# EAGLE design Cleaning_Robot (EAGLE 9.6.2)
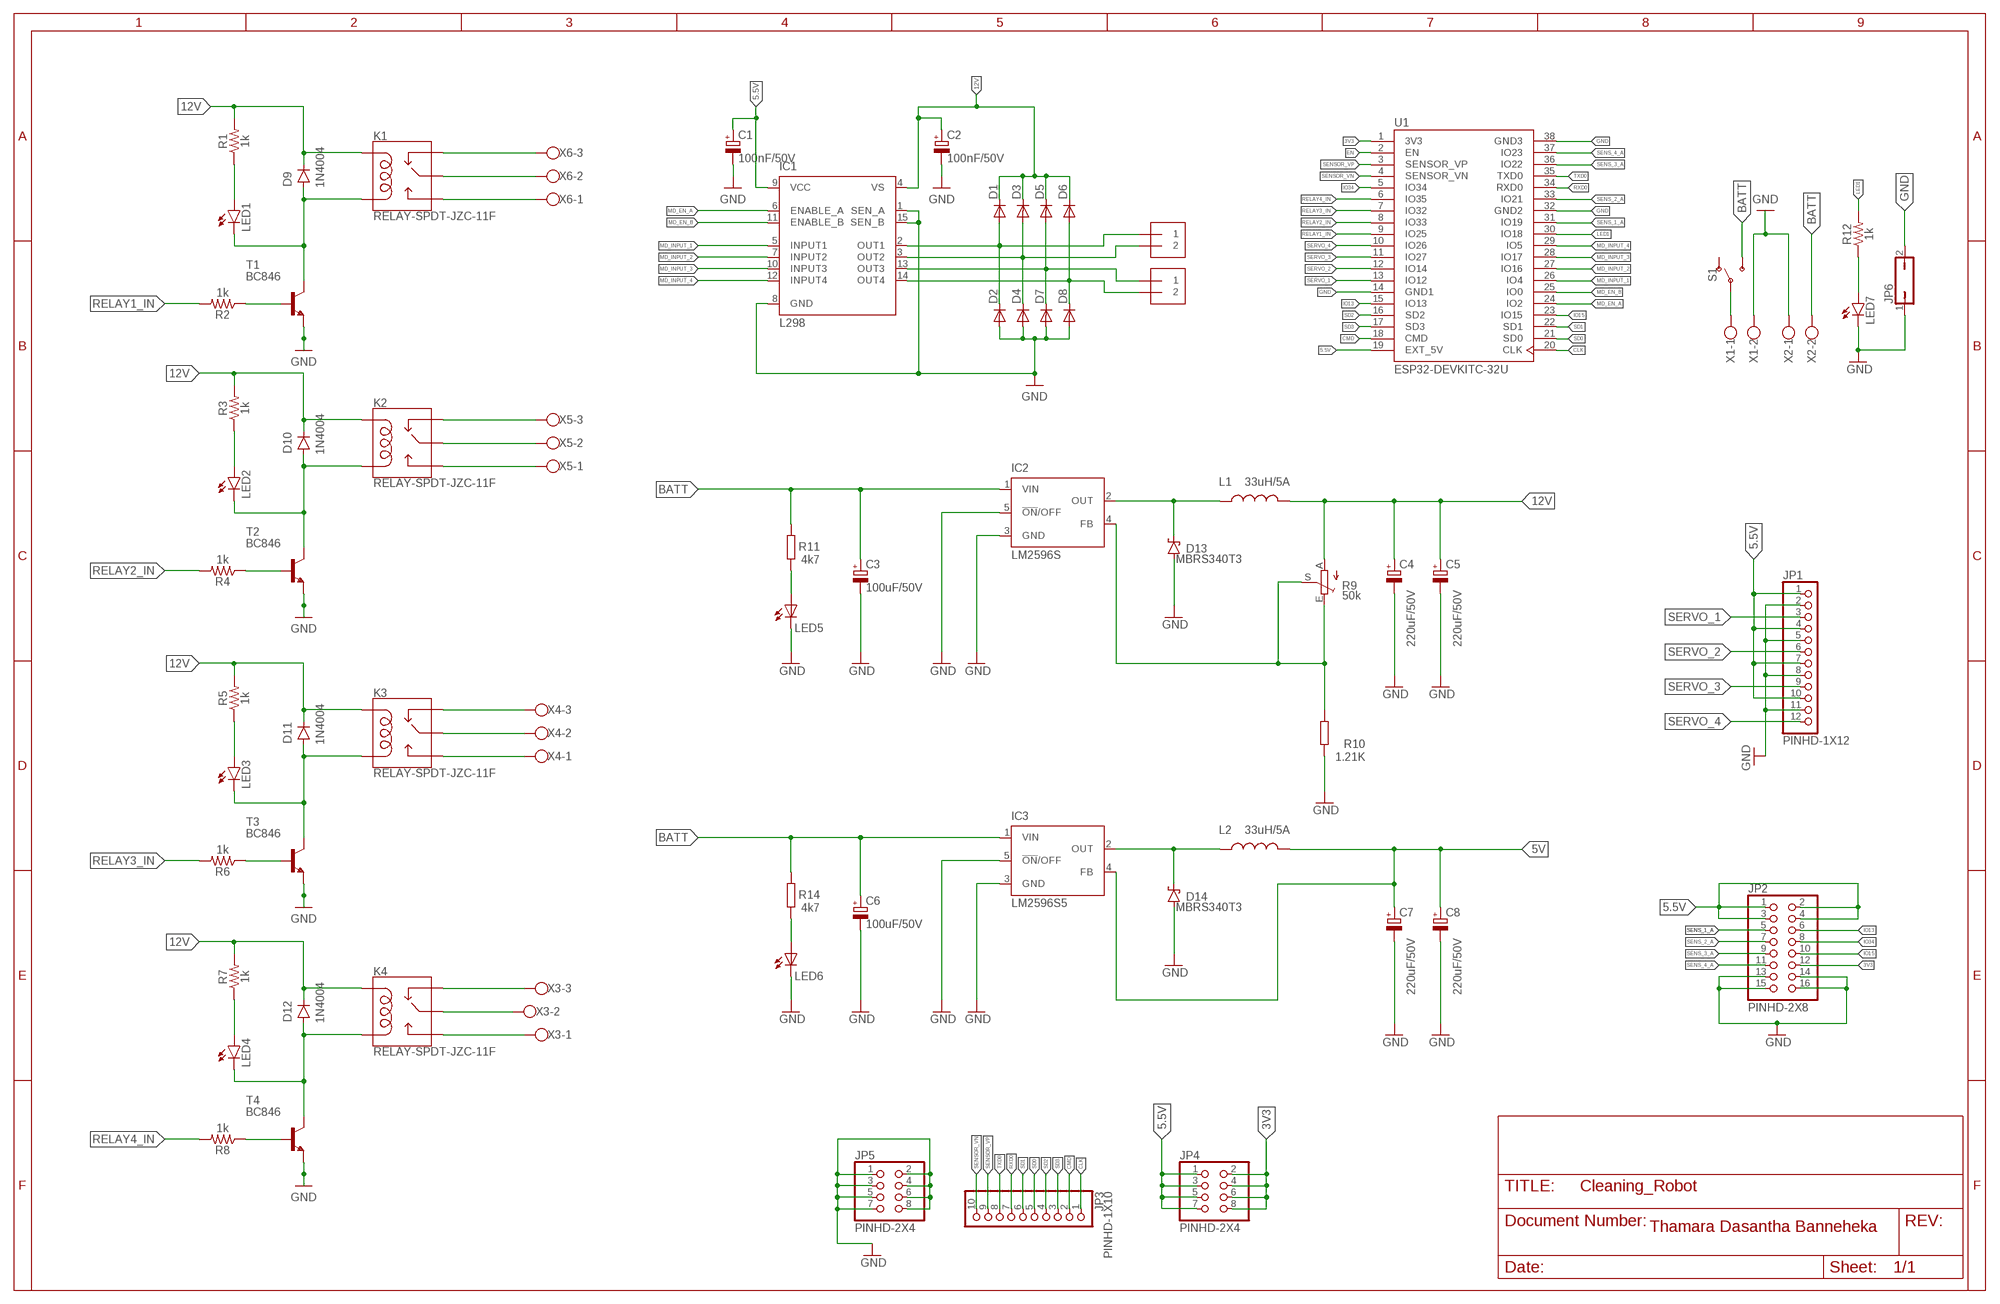
[diagram p0: schematic, sheet 1]

## Parts
C1  100nF/50V  CPOL-EU153CLV-0405  [153CLV-0405]
C2  100nF/50V  CPOL-EU153CLV-0405  [153CLV-0405]
C3  100uF/50V  CPOL-EU153CLV-0810  [153CLV-0810]
C4  220uF/50V  CPOL-EU140CLH-1010  [140CLH-1010]
C5  220uF/50V  CPOL-EU140CLH-1010  [140CLH-1010]
C6  100uF/50V  CPOL-EU153CLV-0810  [153CLV-0810]
C7  220uF/50V  CPOL-EU153CLV-1010  [153CLV-1010]
C8  220uF/50V  CPOL-EU153CLV-1010  [153CLV-1010]
D1  DIODE-SOD123  [SOD123]
D2  DIODE-SOD123  [SOD123]
D3  DIODE-SOD123  [SOD123]
D4  DIODE-SOD123  [SOD123]
D5  DIODE-SOD123  [SOD123]
D6  DIODE-SOD123  [SOD123]
D7  DIODE-SOD123  [SOD123]
D8  DIODE-SOD123  [SOD123]
D9  1N4004  [DO-41]
D10  1N4004  [DO-41]
D11  1N4004  [DO-41]
D12  1N4004  [DO-41]
D13  MBRS340T3  [SMC]
D14  MBRS340T3  [SMC]
IC1  L298  [MULTIWATT-15]
IC2  LM2596S  [TO263-5]
IC3  LM2596S5  LM2596S  [TO263-5]
J2  1X2-3.5MM  [1X2-3.5MM]
J3  1X2-3.5MM  [1X2-3.5MM]
JP1  PINHD-1X12  [1X12]
JP2  PINHD-2X8  [2X08]
JP3  PINHD-1X10  [1X10]
JP4  PINHD-2X4  [2X04]
JP5  PINHD-2X4  [2X04]
JP6  JP1Q  [JP1]
K1  RELAY-SPDT-JZC-11F  [RELAY-JZC]
K2  RELAY-SPDT-JZC-11F  [RELAY-JZC]
K3  RELAY-SPDT-JZC-11F  [RELAY-JZC]
K4  RELAY-SPDT-JZC-11F  [RELAY-JZC]
L1  33uH/5A  INDUCTORPWR  [CDRH125]
L2  33uH/5A  INDUCTORPWR  [CDRH125]
LED1  LEDCHIP-LED0805  [CHIP-LED0805]
LED2  LEDCHIP-LED0805  [CHIP-LED0805]
LED3  LEDCHIP-LED0805  [CHIP-LED0805]
LED4  LEDCHIP-LED0805  [CHIP-LED0805]
LED5  LEDCHIPLED_0805  [CHIPLED_0805]
LED6  LEDCHIPLED_0805  [CHIPLED_0805]
LED7  LEDCHIP-LED0805  [CHIP-LED0805]
R1  1k  RESISTOR0805  [0805]
R2  1k  RESISTOR0805  [0805]
R3  1k  RESISTOR0805  [0805]
R4  1k  RESISTOR0805  [0805]
R5  1k  RESISTOR0805  [0805]
R6  1k  RESISTOR0805  [0805]
R7  1k  RESISTOR0805  [0805]
R8  1k  RESISTOR0805  [0805]
R9  50k  TRIM_EU-S64W  [S64W]
R10  1.21K  R-EU_R0805  [R0805]
R11  4k7  R-EU_R0805  [R0805]
R12  1k  RESISTOR0805  [0805]
R14  4k7  R-EU_R0805  [R0805]
S1  SWITCH-SPDT-PTH-11.6X4.0MM-KIT  [SWITCH_SPDT_PTH_11.6X4.0MM_KIT]
T1  BC846  [SOT23]
T2  BC846  [SOT23]
T3  BC846  [SOT23]
T4  BC846  [SOT23]
U1  ESP32-DEVKITC-32U  [MODULE_ESP32-DEVKITC-32U]
X1  W237-102  [W237-102]
X2  W237-102  [W237-102]
X3  W237-103  [W237-103]
X4  W237-103  [W237-103]
X5  W237-103  [W237-103]
X6  W237-103  [W237-103]

## Nets
3V3: JP2.12 JP4.2 JP4.4 JP4.6 JP4.8 U1.1(3V3)
5.5V: C1.+ IC1.9(VCC) JP1.1 JP1.4 JP1.7 JP1.10 JP2.1 JP2.2 JP2.3 JP2.4 JP4.1 JP4.3 JP4.5 JP4.7 U1.19(EXT_5V)
5V: C7.+ C8.+ IC3.4(FB) L2.2
12V: C2.+ C4.+ C5.+ D1.C D3.C D5.C D6.C D9.C D10.C D11.C D12.C IC1.4(VS) K1.5(COIL1) K2.5(COIL1) K3.5(COIL1) K4.5(COIL1) L1.2 R1.2 R3.2 R5.2 R7.2 R9.A
BATT: C3.+ C6.+ IC2.1(VIN) IC3.1(VIN) R11.2 R14.2 S1.3(S) X2.2
CLK: JP3.1 U1.20(CLK)
CMD: JP3.2 U1.18(CMD)
COM: K1.4(MAIN) K2.4(MAIN) K3.4(MAIN) X4.2 X5.2 X6.2
EN: U1.2(EN)
GND: C1.- C2.- C3.- C4.- C5.- C6.- C7.- C8.- D2.A D4.A D7.A D8.A D13.A D14.A IC1.1(SEN_A) IC1.8(GND) IC1.15(SEN_B) IC2.3(GND) IC2.5(!ON!/OFF) IC3.3(GND) IC3.5(!ON!/OFF) JP1.2 JP1.5 JP1.8 JP1.11 JP2.13 JP2.14 JP2.15 JP2.16 JP5.1 JP5.2 JP5.3 JP5.4 JP5.5 JP5.6 JP5.7 JP5.8 JP6.1 JP6.2 LED5.C LED6.C LED7.C R10.1 T1.2(E) T2.2(E) T3.2(E) T4.2(E) U1.14(GND1) U1.32(GND2) U1.38(GND3) X1.2 X2.1
IO13: JP2.6 U1.15(IO13)
IO15: JP2.10 U1.23(IO15)
IO34: JP2.8 U1.5(IO34)
LED1: R12.2 U1.30(IO18)
MD_EN_A: IC1.6(ENABLE_A) U1.24(IO2)
MD_EN_B: IC1.11(ENABLE_B) U1.25(IO0)
MD_INPUT_1: IC1.5(INPUT1) U1.26(IO4)
MD_INPUT_2: IC1.7(INPUT2) U1.27(IO16)
MD_INPUT_3: IC1.10(INPUT3) U1.28(IO17)
MD_INPUT_4: IC1.12(INPUT4) U1.29(IO5)
N$1: D1.A D2.C IC1.2(OUT1) J2.1
N$2: D3.A D4.C IC1.3(OUT2) J2.2
N$3: D6.A D8.C IC1.14(OUT4) J3.2
N$4: D5.A D7.C IC1.13(OUT3) J3.1
N$5: D10.A K2.1(COIL2) LED2.C T2.3(C)
N$6: LED2.A R3.1
N$7: R4.1 T2.1(B)
N$8: D9.A K1.1(COIL2) LED1.C T1.3(C)
N$9: D11.A K3.1(COIL2) LED3.C T3.3(C)
N$10: LED1.A R1.1
N$11: LED3.A R5.1
N$12: R2.1 T1.1(B)
N$13: R6.1 T3.1(B)
N$14: D12.A K4.1(COIL2) LED4.C T4.3(C)
N$15: LED4.A R7.1
N$16: R8.1 T4.1(B)
N$17: K4.2(NC) X3.3
N$18: D13.C IC2.2(OUT) L1.1
N$19: K4.4(MAIN) X3.2
N$20: IC2.4(FB) R9.E R9.S R10.2
N$21: LED5.A R11.1
N$22: K4.3(NO) X3.1
N$23: D14.C IC3.2(OUT) L2.1
N$26: LED6.A R14.1
N$37: S1.2(P) X1.1
N$44: LED7.A R12.1
NC: K1.2(NC) K2.2(NC) K3.2(NC) X4.3 X5.3 X6.3
NO: K1.3(NO) K2.3(NO) K3.3(NO) X4.1 X5.1 X6.1
RELAY1_IN: R2.2 U1.9(IO25)
RELAY2_IN: R4.2 U1.8(IO33)
RELAY3_IN: R6.2 U1.7(IO32)
RELAY4_IN: R8.2 U1.6(IO35)
RXD0: JP3.7 U1.34(RXD0)
SD0: JP3.5 U1.21(SD0)
SD1: JP3.6 U1.22(SD1)
SD2: JP3.4 U1.16(SD2)
SD3: JP3.3 U1.17(SD3)
SENS_1_A: JP2.5 U1.31(IO19)
SENS_2_A: JP2.7 U1.33(IO21)
SENS_3_A: JP2.9 U1.36(IO22)
SENS_4_A: JP2.11 U1.37(IO23)
SENSOR_VN: JP3.10 U1.4(SENSOR_VN)
SENSOR_VP: JP3.9 U1.3(SENSOR_VP)
SERVO_1: JP1.3 U1.13(IO12)
SERVO_2: JP1.6 U1.12(IO14)
SERVO_3: JP1.9 U1.11(IO27)
SERVO_4: JP1.12 U1.10(IO26)
TXD0: JP3.8 U1.35(TXD0)
Unconnected: S1.1(O)

## Notes on the sheet
- Thamara Dasantha Banneheka

## Library data of the parts
C1-C8 = rcl:CPOL-EU: POLARIZED CAPACITOR, European symbol; SPICEPREFIX: C
D1-D8 = diode:DIODE-: DIODE
D9-D12 = Diodes:1N4004: DIODE GEN PURP 400V 1A DO41 Manufacturer's datasheet <https://www.mccsemi.com/pdf/Products/1N4001-1N4007(DO-41).pdf>; CREATED_BY: PCBLayout.com; DIGIKEY_PART_NUMBER: 1N4004MSCT-ND; MANUFACTURER: Micro Commercial Co; MPN: 1N4004; PACKAGE: DO-41
D13 D14 = diode:MBRS3*0T3: SCHOTTKY BARRIER RECTIFIER 3.0 AMPERES 20, 30, 40 VOLT Source: MBRS340T3-D.pdf
IC1 = st-microelectronics:L298: DUAL FULL-BRIDGE DRIVER; MPN: L298N; OC_FARNELL: 1589425; OC_NEWARK: 32M1527
IC2 IC3 = national-semiconductor:LM2596: SIMPLE SWITCHER® Power Converter 150 kHz 3A Step-Down Voltage Regulator Source: http://www.national.com/ds/LM/LM2596.pdf; MF: NATIONAL SEMICONDUCTOR; MPN: LM2596S-ADJ/NOPB; OC_FARNELL: 9494367; OC_NEWARK: 41K3842
J2 J3 = adafruit:1X2: 3.5mm Terminal block http://www.ladyada.net/library/pcb/eaglelibrary.html
JP1 = Connector:PINHD-1X12: PIN HEADER; CATEGORY: CONNECTOR; SUB-CATEGORY: PIN-HEADER
JP2 = Connector:PINHD-2X8: PIN HEADER; CATEGORY: CONNECTOR; SUB-CATEGORY: PIN-HEADER
JP3 = Connector:PINHD-1X10: PIN HEADER; CATEGORY: Headers; DESCRIPTION: Header, Straight, 10 Position; MANUFACTURER: Generic; MPN: Generic; OPERATING_TEMPERATURE: Generic; PART_STATUS: Active; PITCH: 0.100" (2.54mm); ROHS_COMPLIANCE: Generic; SERIES: Generic; SUB-CATEGORY: Headers, Male Pins; TYPE: Board to Board or Cable, Unshrouded, Through Hole, Straight
JP4 JP5 = Connector:PINHD-2X4: PIN HEADER; CATEGORY: Headers; DESCRIPTION: Header, Straight, 2x4 Position; MANUFACTURER: Generic; MPN: Generic; OPERATING_TEMPERATURE: Generic; PART_STATUS: Active; PITCH: 0.100" (2.54mm); ROHS_COMPLIANCE: Generic; SERIES: Generic; SUB-CATEGORY: Headers, Male Pins; TYPE: Board to Board or Cable, Unshrouded, Through Hole, Straight
JP6 = jumper:JP1Q: JUMPER
K1-K4 = SparkFun-Electromechanical:RELAY-SPDT: SPDT Electromechanical Relay Single-pole, double-throw sealed relays. When current is applied to the coil, it throws a simple changeover switch, terminating the connection from the NC contact to ground and closing the NO contact. Use them to switch high voltage/high current devices. SparkFun Products JQX-15F: Relay SPDT Sealed - 20A <https://www.sparkfun.com/products/10924> (COM-10924) JZC-11F: Relay SPDT Sealed <https://www.sparkfun.com/products/100> (COM-00100); PROD_ID: COMP-09533; SF_SKU: COM-00100
L1 L2 = SparkFun-Passives:INDUCTOR: Inductors Basic Inductor/Choke - 0603 and 1206. Footprints are not proven and vary greatly between part numbers.
LED1-LED4 LED7 = led:LED: LED
LED5 LED6 = adafruit:LED: LED
R1-R8 R12 = SparkFun-Resistors:RESISTOR: Generic Resistor Package
R9 = pot:TRIM_EU-: POTENTIOMETER
R10 R11 R14 = rcl:R-EU_: RESISTOR, European symbol; SPICEPREFIX: R
S1 = SparkFun-Switches:SWITCH-SPDT: Single Pole, Double Throw (SPDT) Switch Single-pole, double-throw (SPDT) switch. Variant Overview SMD-AYZ0202 Surface Mount DPDT Switch <https://www.sparkfun.com/products/597> (COM-00597) Used on e.g. LilyPad Arduino USB - ATmega32U4 Board <https://www.sparkfun.com/products/12049> PTH-11.6X4.0MM SPDT Mini Power Switch <https://www.sparkfun.com/products/102> (COM-00102) Used on e.g. SparkFun Simon Says - Through-Hole Soldering Kit <https://www.sparkfun.com/products/10547> (KIT-10547) PTH-11.6X4.0MM-KIT KIT version of SPDT Mini Power Switch - Simplifies soldering by removing tStop of switch pins - only one side can be soldered. PTH-11.6X4.0MM-LOCK LOCK version of SPDT Mini Power Switch - Offset pins hold switch in place for easier soldering. SMD-RIGHT-ANGLE Surface Mount Right Angle Switch <https://www.sparkfun.com/products/10860> (COM-10860) Used on e.g. SparkFun ESP8266 Thing <https://www.sparkfun.com/products/13231>; PROD_ID: SWCH-08261; SF_SKU: COM-00102
T1-T4 = transistor:BC846: NPN TRANSISTOR
U1 = ESP32-DEVKITC-32U:ESP32-DEVKITC-32U: ESP32-DEVKITC Check availability <https://pricing.snapeda.com/parts/ESP32-DEVKITC-32U/Espressif%20Systems/view-part?ref=eda>; AVAILABILITY: In Stock; DESCRIPTION: ESP32-WROOM-32UE series Transceiver; 802.11 b/g/n (Wi-Fi, WiFi, WLAN), Bluetooth® Smart Ready 4.x Dual Mode Evaluation Board; MF: Espressif Systems; MP: ESP32-DEVKITC-32U; PACKAGE: CUSTOM-38 ESPRESSIF; PRICE: None; PURCHASE-URL: https://pricing.snapeda.com/search?q=ESP32-DEVKITC-32U&ref=eda
X1 X2 = con-wago-500:W237-102: WAGO SCREW CLAMP; MPN: 237-102; OC_FARNELL: unknown; OC_NEWARK: 70K9898
X3-X6 = con-wago-500:W237-103: WAGO SCREW CLAMP; MPN: 237-103; OC_FARNELL: unknown; OC_NEWARK: 18M7116

## Board
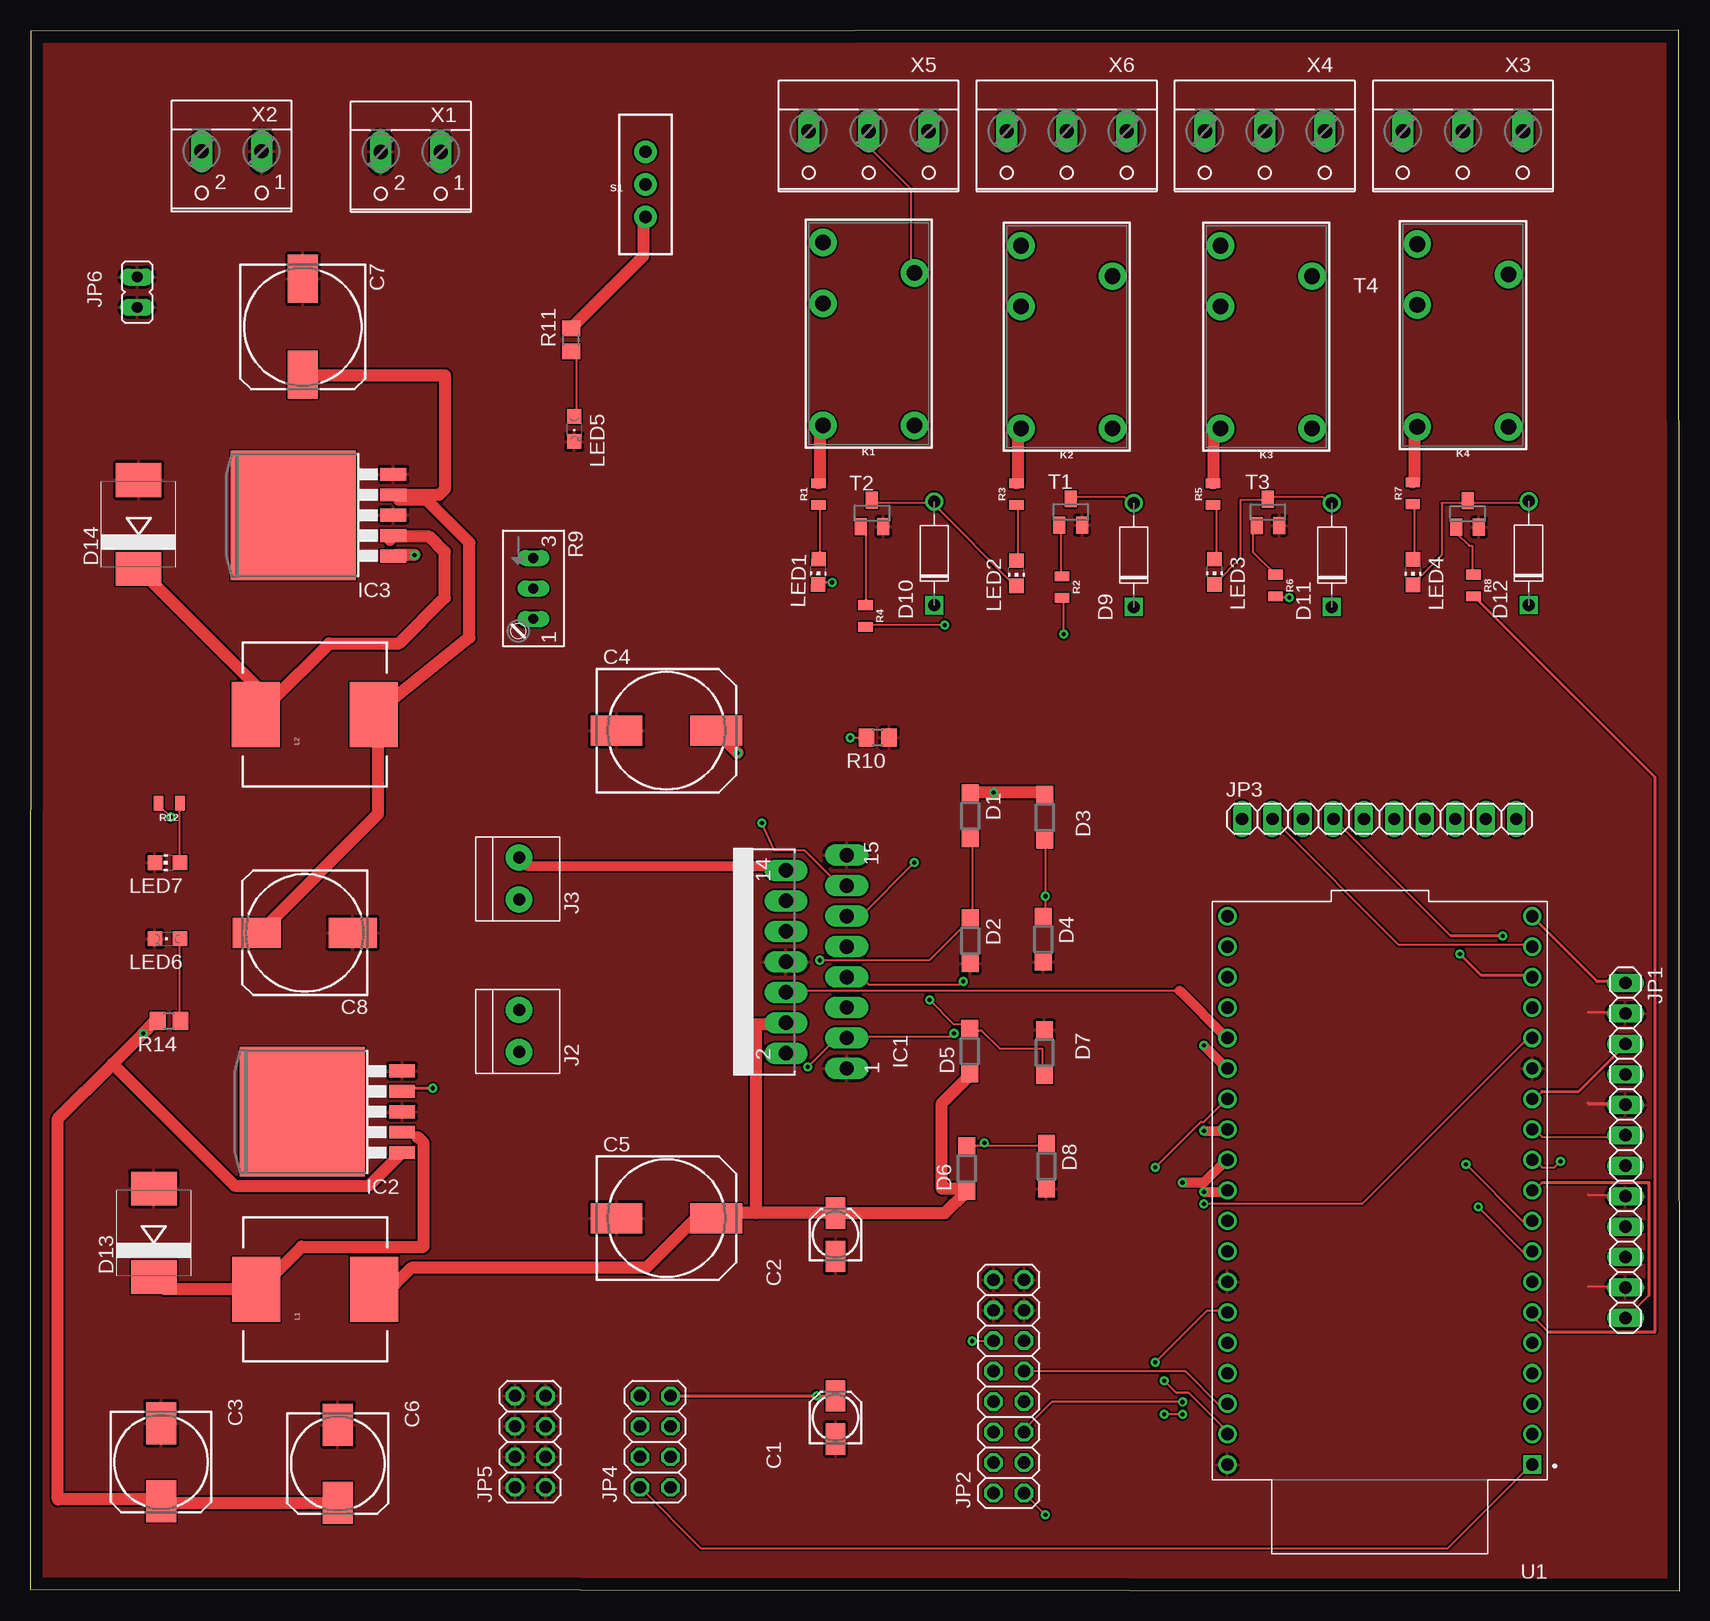
[diagram p1: board, top side]
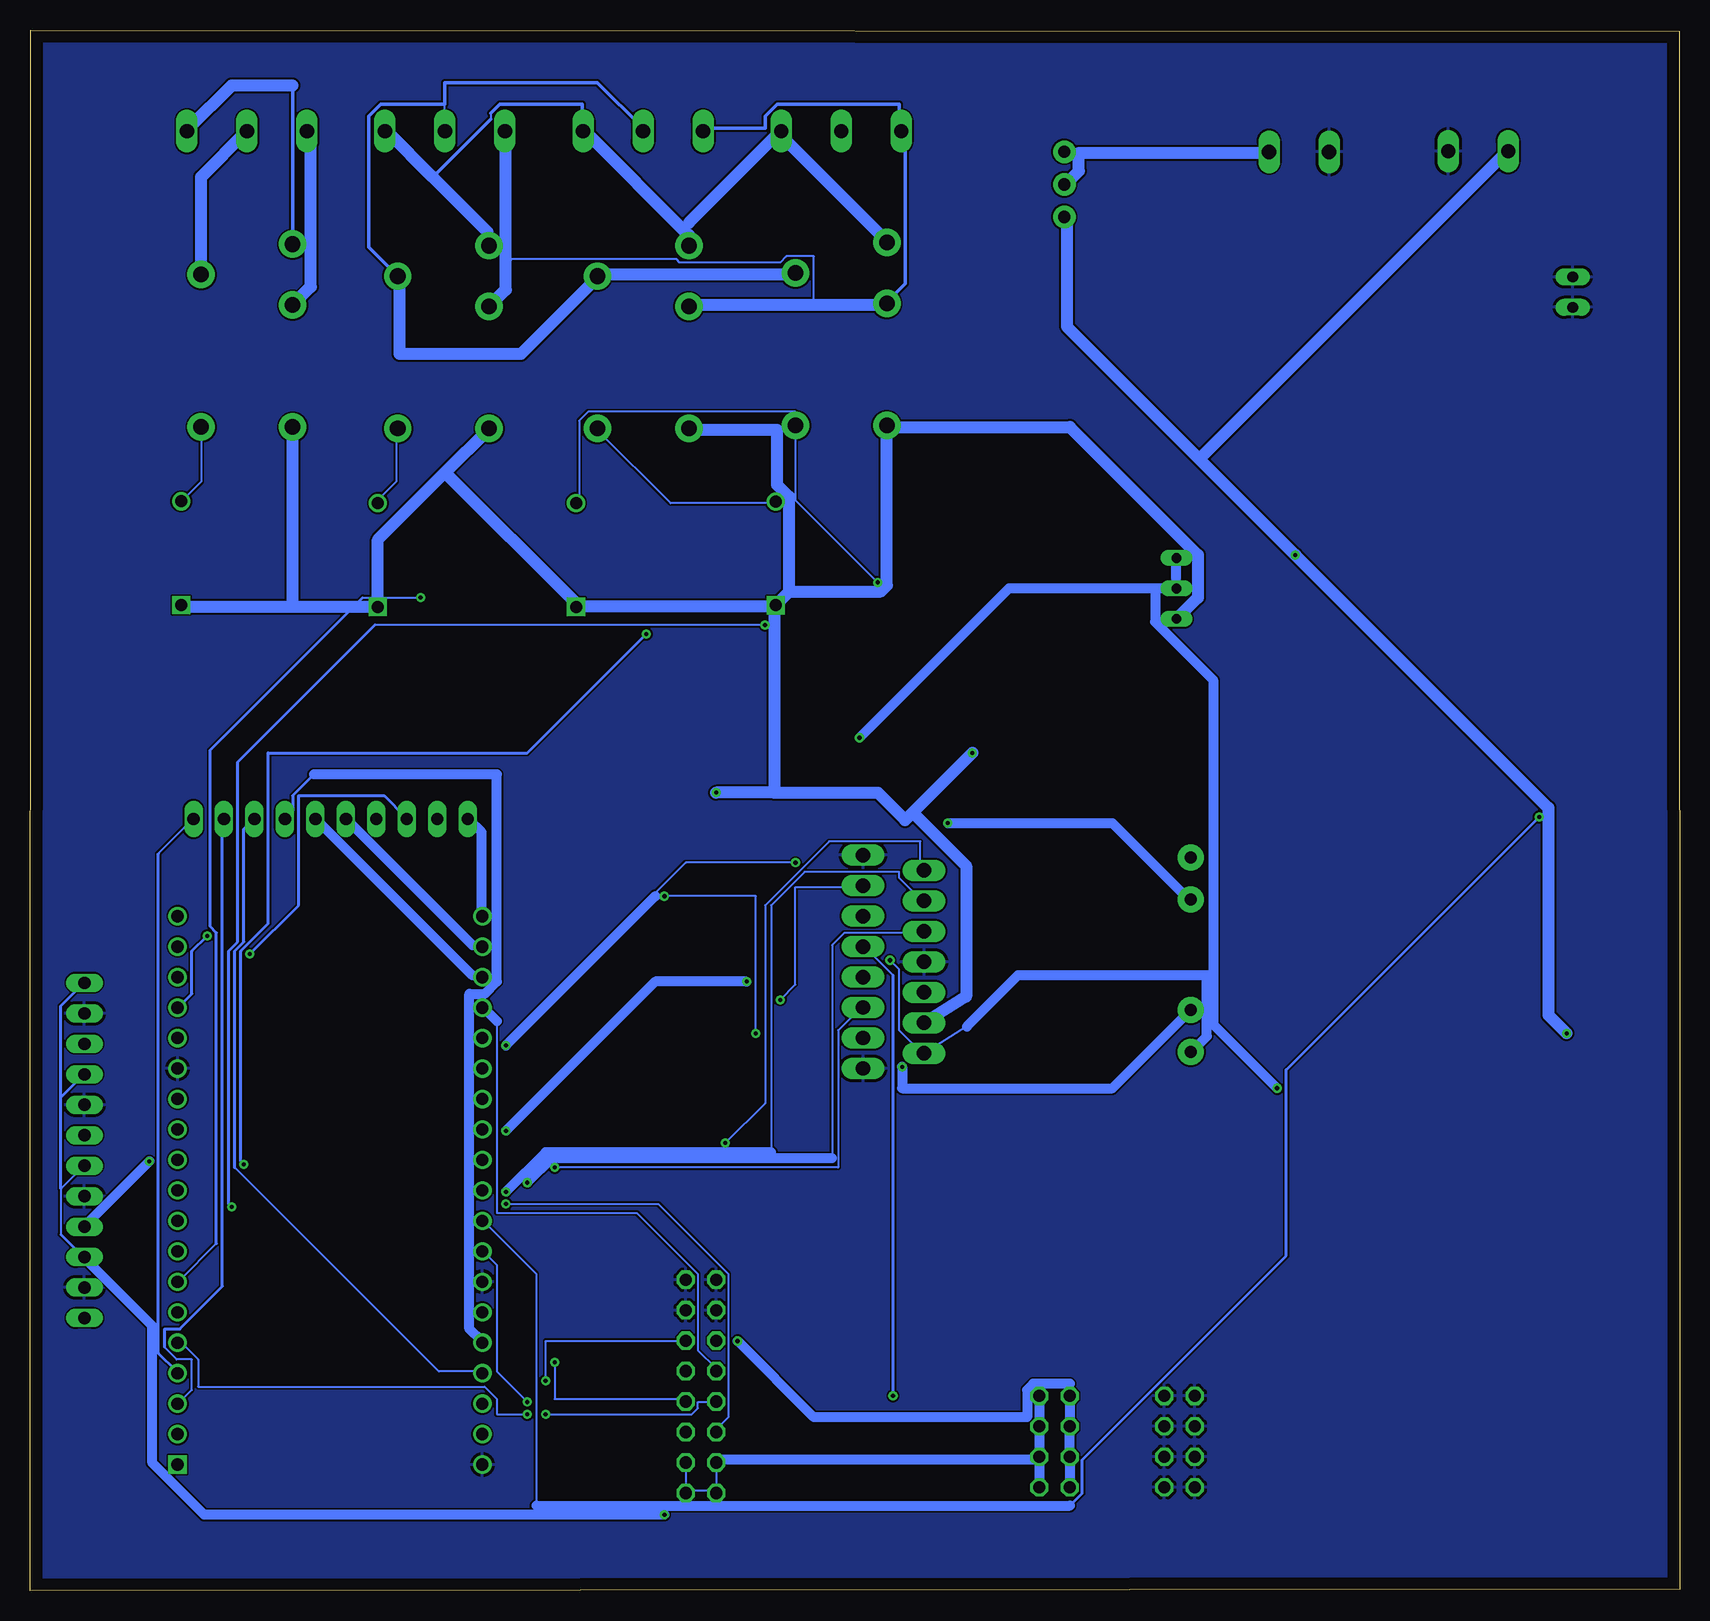
[diagram p2: board, bottom side, seen from below]

Size 137.49 x 130.12 mm. Coordinates in mm from the lower left corner, seen from the top.
Outline: 0,0.14 137.49,0 137.41,130.12 0.05,130.01 0,0.14
Copper layers (1*16): Top 0.035mm / dielectric 1.5mm / Bottom 0.035mm
Design rules "default": minimum track width 6mil, minimum drill 0.35mm, track to track 6mil, track to pad 6mil, pad to pad 6mil, via to via 6mil, smd to smd 6mil, copper to edge 40mil, drill to drill 6mil, minimum pad ring 10mil, minimum via ring 8mil, stop-mask expansion 4mil, vias tented up to drill 0mil, thermal gap 10mil

### Footprints (pad centres in the part's own frame; a part is rotated, then mirrored left to right if it is on the bottom)
153CLV-0405 = smd 2.6 x 1.6: + 1.8,0; - -1.8,0
153CLV-0810 = smd 3.5 x 2.5: + 3.25,0; - -3.25,0
140CLH-1010 = smd 4.3 x 2.5: + 4.15,0; - -4.15,0
153CLV-1010 = smd 4 x 2.5: + 4,0; - -4,0
SOD123 = smd 1.4 x 1.4: A 1.9,0; C -1.9,0
DO-41 = drill 1: A 4.325,0 | drill 1 square: C -4.325,0
SMC = smd 2.8 x 3.8: A 3.7,0; C -3.7,0
MULTIWATT-15 = drill 1.2 long: 1 -8.89,-7.62; 2 -7.62,-2.54; 3 -6.35,-7.62; 4 -5.08,-2.54; 5 -3.81,-7.62; 6 -2.54,-2.54; 7 -1.27,-7.62; 8 0,-2.54; 9 1.27,-7.62; 10 2.54,-2.54; 11 3.81,-7.62; 12 5.08,-2.54; 13 6.35,-7.62; 14 7.62,-2.54; 15 8.89,-7.62
TO263-5 = smd 1.067 x 2.159: 1 -3.404,-5.791; 2 -1.702,-5.791; 3 0,-5.791; 4 1.702,-5.791; 5 3.404,-5.791 | smd 10.8 x 10.41: 6 0,2.54
1X2-3.5MM = drill 1 pad 2.184: 1 1.8,0; 2 -1.7,0
1X12 = drill 1.016 long: 1 -13.97,0; 2 -11.43,0; 3 -8.89,0; 4 -6.35,0; 5 -3.81,0; 6 -1.27,0; 7 1.27,0; 8 3.81,0; 9 6.35,0; 10 8.89,0; 11 11.43,0; 12 13.97,0
2X08 = drill 1.016 octagon: 1 -8.89,-1.27; 2 -8.89,1.27; 3 -6.35,-1.27; 4 -6.35,1.27; 5 -3.81,-1.27; 6 -3.81,1.27; 7 -1.27,-1.27; 8 -1.27,1.27; 9 1.27,-1.27; 10 1.27,1.27; 11 3.81,-1.27; 12 3.81,1.27; 13 6.35,-1.27; 14 6.35,1.27; 15 8.89,-1.27; 16 8.89,1.27
1X10 = drill 1.016 long: 1 -11.43,0; 2 -8.89,0; 3 -6.35,0; 4 -3.81,0; 5 -1.27,0; 6 1.27,0; 7 3.81,0; 8 6.35,0; 9 8.89,0; 10 11.43,0
2X04 = drill 1.016 octagon: 1 -3.81,-1.27; 2 -3.81,1.27; 3 -1.27,-1.27; 4 -1.27,1.27; 5 1.27,-1.27; 6 1.27,1.27; 7 3.81,-1.27; 8 3.81,1.27
JP1 = drill 0.914 long: 1 0,-1.27; 2 0,1.27
RELAY-JZC = drill 1.3 pad 2.286: 1 3.81,-8.89; 2 -3.81,1.27; 3 -3.81,6.35; 4 3.81,3.81; 5 -3.81,-8.89
CDRH125 = smd 5.4 x 4: 1 0,4.9; 2 0,-4.9
CHIP-LED0805 = smd 1.2 x 1.2: A 0,-1.05; C 0,1.05
CHIPLED_0805 = smd 1.2 x 1.2: A 0,-1.05; C 0,1.05
0805 = smd 0.8 x 1.2: 1 -0.9,0; 2 0.9,0
S64W = drill 0.813 long: A 2.54,1.27; E -2.54,1.27; S 0,1.27
R0805 = smd 1.3 x 1.5: 1 -0.95,0; 2 0.95,0
SWITCH_SPDT_PTH_11.6X4.0MM_KIT = drill 1.016 pad 1.88: 1 0,2.718; 2 0,0; 3 0,-2.718
SOT23 = smd 1 x 1.4: 1 -0.95,-1.1; 2 0.95,-1.1; 3 0,1.1
MODULE_ESP32-DEVKITC-32U = drill 1.02 square: 1 -12.7,22.85 | drill 1.02: 2 -12.7,20.31; 3 -12.7,17.77; 4 -12.7,15.23; 5 -12.7,12.69; 6 -12.7,10.15; 7 -12.7,7.61; 8 -12.7,5.07; 9 -12.7,2.53; 10 -12.7,-0.01; 11 -12.7,-2.55; 12 -12.7,-5.09; 13 -12.7,-7.63; 14 -12.7,-10.17; 15 -12.7,-12.71; 16 -12.7,-15.25; 17 -12.7,-17.79; 18 -12.7,-20.33; 19 -12.7,-22.87; 20 12.7,-22.87; 21 12.7,-20.33; 22 12.7,-17.79; 23 12.7,-15.25; 24 12.7,-12.71; 25 12.7,-10.17; 26 12.7,-7.63; 27 12.7,-5.09; 28 12.7,-2.55; 29 12.7,-0.01; 30 12.7,2.53; 31 12.7,5.07; 32 12.7,7.61; 33 12.7,10.15; 34 12.7,12.69; 35 12.7,15.23; 36 12.7,17.77; 37 12.7,20.31; 38 12.7,22.85
W237-102 = drill 1.194 long: 1 -2.5,-1.27; 2 2.5,-1.27
W237-103 = drill 1.194 long: 1 -5,-1.29; 2 0,-1.29; 3 5,-1.29

### Placement (x,y rotation side)
C1  67.12,14.46 90 top
C2  67.12,29.7 90 top
C3  10.92,10.74 270 top
C4  53.04,71.72 0 top
C5  53.04,31.08 0 top
C6  25.66,10.62 270 top
C7  22.73,105.38 270 top
C8  22.9,54.86 180 top
D1  78.35,64.6 270 top
D2  78.35,54.19 270 top
D3  84.57,64.48 270 top
D4  84.45,54.32 270 top
D5  78.31,45 90 top
D6  78.06,35.22 90 top
D7  84.53,44.87 90 top
D8  84.7,35.4 270 top
D9  91.98,86.36 90 top
D10  75.35,86.49 90 top
D11  108.49,86.36 90 top
D12  124.88,86.51 90 top
D13  10.32,29.84 90 top
D14  9.05,88.9 90 top
IC1  60.45,52.45 90 top
IC2  25.21,39.94 90 top
IC3  24.49,89.67 90 top
J2  40.76,46.74 270 top
J3  40.76,59.44 270 top
JP1  132.95,36.72 270 top
JP2  81.57,17.05 90 top
JP3  112.43,64.36 0 top
JP4  52.11,12.45 90 top
JP5  41.69,12.45 90 top
JP6  8.93,108.27 0 top
K1  69.89,106.04 0 top
K2  86.4,105.79 0 top
K3  103.03,105.79 0 top
K4  119.42,105.92 0 top
L1  23.77,25.14 90 top
L2  23.73,73.06 90 top
LED1  65.69,84.96 178.9 top
LED2  82.2,84.84 180 top
LED3  98.71,84.96 180 top
LED4  115.26,84.93 180 top
LED5  45.35,96.87 180 top
LED6  11.47,54.36 90 top
LED7  11.47,60.71 90 top
R1  65.69,91.44 90 top
R2  86.01,83.69 270 top
R3  82.2,91.44 90 top
R4  69.63,81.28 270 top
R5  98.59,91.44 90 top
R6  103.79,83.82 270 top
R7  115.23,91.5 90 top
R8  120.3,83.82 270 top
R9  40.68,83.57 270 top
R10  70.65,71.12 180 top
R11  45.09,104.29 90 top
R12  11.59,65.66 180 top
R14  11.59,47.5 180 top
S1  51.29,117.25 0 top
T1  86.72,89.94 0 top
T2  70.16,89.82 0 top
T3  103.16,89.92 0 top
T4  119.8,89.79 0 top
U1  112.49,33.38 180 top
X1  31.73,118.69 180 top
X2  16.8,118.75 180 top
X3  119.42,120.4 180 top
X4  102.91,120.4 180 top
X5  69.89,120.4 180 top
X6  86.4,120.4 180 top

### Tracks (layer width: path | path; a pad name or v marks a point on that pad's centre or on a via)
3V3  (via drill 0.35)
  Top 0.152: v78.52,20.83 80.3,20.83 JP2.12 | JP4.2 55.92,3.56 118.15,3.56 125,10.41 U1.1
  Bottom 0.152: JP4.8 50.84,17.27
  Bottom 0.813: JP4.8 JP4.6 JP4.4 JP4.2 | v78.52,20.83 72.17,14.48 54.39,14.48 54.39,16.76 53.88,17.27 50.84,17.27
5.5V  (via drill 0.35)
  Top 0.152: 125.26,56.13 U1.19 | 132.88,50.8 JP1.1 | v84.62,6.35 82.84,8.13 JP2.1
  Top 0.254: 125.26,56.13 130.59,50.8 132.88,50.8 | JP4.7 v65.57,16.26 C1.+
  Bottom 0.152: 134.91,29.72 134.91,33.53 133.13,35.31 JP1.7 | 133.13,27.94 JP1.10 132.88,27.69 | 133.13,42.93 JP1.4 | 133.13,50.55 JP1.1 | 80.3,8.38 JP2.4 80.3,10.92 | JP2.3 82.84,8.38 | 82.84,8.38 80.3,8.38 | 80.3,8.38 JP2.2 | 82.84,8.38 JP2.1 | 65.57,51.31 67.85,53.59 IC1.9 | 53.38,10.92 JP4.3
  Bottom 0.254: 134.91,29.72 133.13,27.94 | 134.91,41.15 133.13,42.93 | 134.91,33.53 134.91,41.15 | 133.13,50.55 134.91,48.77 134.91,41.15 | v65.57,16.26 65.57,51.31
  Bottom 0.813: JP4.1 53.38,10.92 80.3,10.92 | JP4.7 JP4.5 JP4.3 | 132.88,27.69 127.29,22.1 127.29,10.67 122.97,6.35 v84.62,6.35
5V
  Top 0.152: 22.9,101.35 C7.+ | 28.99,72.9 28.74,72.9 L2.2 | 19.09,54.86 C8.+ | 30.77,90.93 30.52,91.19 IC3.4
  Top 1.016: IC3.4 34.09,91.38 34.58,91.86 34.58,101.35 22.9,101.35 | 19.09,54.86 28.99,64.77 28.99,72.9 | 30.77,90.93 33.06,90.93 36.61,87.38 36.61,79.46 30.97,74.94 L2.2
12V  (via drill 0.35)
  Top 1.016: D5.C 78.27,42.93 75.98,40.64 75.98,33.53 78.01,33.53 D6.C 78.01,33.27 76.24,31.5 C2.+ 60.49,31.5 | 60.49,31.5 57.44,31.5 57.19,31.24 C5.+ 57.19,30.99 55.41,30.99 51.34,26.92 31.79,26.92 30.23,25.37 L1.2 | K4.5 115.35,97.03 115.35,92.46 R7.2 | R5.2 98.59,96.77 99.09,96.77 K3.5 | R1.2 65.82,92.46 65.82,97.03 66.08,97.03 K1.5 | R3.2 82.33,92.46 82.33,96.77 82.59,96.77 K2.5 | D1.C 78.52,66.55 v80.3,66.55 84.36,66.55 D3.C | v58.96,69.85 57.19,71.63 C4.+ | 60.49,31.5 60.49,47.24 62.77,47.24 IC1.4
  Bottom 1.016: 115.61,82.04 124.75,82.04 D12.C | 115.61,82.04 D11.C | 102.91,93.22 108.49,87.63 D11.C | 102.91,93.22 K3.5 | D11.C | 115.61,82.04 K4.5 | R9.A 40.17,82.8 40.17,86.36 50.84,97.03 66.08,97.03 | 75.47,82.04 D9.C | 75.47,66.55 v80.3,66.55 | 75.47,82.04 75.47,66.55 | 75.47,82.04 D10.C 75.22,82.3 74.2,83.31 | 63.92,64.9 59.47,60.45 59.47,49.55 IC1.4 | 75.47,66.55 66.84,66.55 64.55,64.26 63.92,64.9 | 63.92,64.9 v58.96,69.85 | 74.2,83.31 74.2,91.19 75.22,92.2 75.22,96.77 82.59,96.77 K2.5 | 66.08,97.03 66.08,83.82 66.58,83.31 74.2,83.31 | 66.08,97.03 K1.5 | 102.91,93.22 91.98,82.3 D9.C | D9.C
BATT  (via drill 0.35)
  Top 1.016: 6.89,43.94 2.32,39.37 2.32,7.62 9.94,7.62 | 6.89,43.94 v9.43,46.48 10.45,47.5 R14.2 | 9.94,7.62 10.7,7.62 C3.+ 9.94,7.62 | 6.89,43.94 17.05,33.78 28.23,33.78 30.77,36.32 IC2.1 | 9.94,7.62 10.19,7.37 C6.+ | R11.2 45.25,105.41 51.09,111.25 51.09,114.3 S1.3 | v32.04,86.36 30.52,86.36 IC3.1
  Bottom 1.016: 39.91,94.23 51.09,105.41 51.09,114.3 S1.3 | 39.91,94.23 v32.04,86.36 10.96,65.28 10.96,48.01 v9.43,46.48 | 39.91,94.23 39.91,94.49 14.51,119.89 X2.2
CLK
  Bottom 0.152: 100.87,64.26 JP3.1 | 99.86,56.39 U1.20
  Bottom 0.813: 100.87,64.26 99.86,63.25 99.86,56.39
CMD
  Top 0.152: JP3.2 103.67,64.26 114.08,53.85 125,53.85 U1.18
COM
  Top 0.152: X5.2 69.89,120.4 73.44,116.84 73.44,109.98 73.7,109.98 K1.4
  Bottom 0.152: 90.21,109.73 K2.4 90.21,109.47 | 73.7,109.73 K1.4 | X4.2 102.91,123.95 | 86.4,121.92 X6.2 | 106.72,109.47 K3.4
  Bottom 0.305: 86.4,121.92 90.21,125.73 102.91,125.73 102.91,123.95 108.24,123.95 109.25,122.94 109.25,112.01 K3.4
  Bottom 1.016: 73.7,109.73 90.21,109.73 | 90.21,109.47 96.56,103.12 106.72,103.12 106.72,109.47
GND
  Top 0.152: 129.83,25.4 132.88,25.4 JP1.11 | 129.83,33.02 132.88,33.02 JP1.8 | 132.88,40.64 JP1.5 | 129.83,48.26 132.88,48.26 JP1.2
  Top 0.254: 129.83,40.64 132.88,40.64
  pour Top: -3.52,136.14 142.53,136.14 142.53,-4.83 -3.52,-4.83
  pour Bottom: -6.06,138.68 -6.06,-7.37 143.8,-7.37 143.8,138.68 141.26,141.22 -3.52,141.22
IO13  (via drill 0.35)
  Top 0.152: v97.83,32.26 111.03,32.26 124.75,45.97 125,45.97 U1.15
  Bottom 0.152: v97.83,32.26 85.12,32.26 79.28,26.42 79.28,14.48 80.3,13.46 JP2.6
IO15
  Bottom 0.152: 98.59,47.5 98.59,31.5 86.9,31.5 81.82,26.42 81.82,20.07 80.3,18.54 JP2.10 | 99.6,48.51 U1.23
  Bottom 0.813: 99.6,48.51 98.59,47.5
IO34  (via drill 0.35)
  Top 0.152: v96.05,14.73 v94.52,14.73
  Bottom 0.152: v94.52,14.73 82.33,14.73 81.82,15.24 81.82,15.75 80.3,15.75 JP2.8 | v96.05,14.73 98.59,14.73 98.59,16 99.6,17.02 123.48,17.02 123.48,19.3 125,20.83 U1.5
LED1  (via drill 0.35)
  Top 0.152: v11.72,64.52 10.7,65.53 R12.2
  Bottom 0.152: 95.28,7.11 95.28,26.42 99.6,30.73 U1.30
  Bottom 0.254: v11.72,64.52 32.8,43.43 32.8,27.94 49.82,10.92 49.82,8.13 50.84,7.11
  Bottom 0.813: 95.28,7.11 50.84,7.11
MD_EN_A
  Top 0.152: 95.79,50.04 63.03,50.04 IC1.6 | 99.6,46.23 U1.24
  Top 0.813: 95.79,50.04 99.6,46.23
MD_EN_B  (via drill 0.35)
  Top 0.152: v73.7,60.71 69.38,56.39 68.11,56.39 IC1.11 | 99.6,43.69 U1.25
  Top 0.813: v97.83,45.47 99.6,43.69
  Bottom 0.152: 85.38,57.91 85.38,58.17 82.84,60.71 v73.7,60.71
  Bottom 0.813: 85.38,57.91 v97.83,45.47
MD_INPUT_1  (via drill 0.35)
  Top 0.152: v93.76,35.31 97.57,39.12 97.83,39.12 99.6,40.89 U1.26
  Bottom 0.152: v93.76,35.31 70.14,35.31 70.14,46.74 68.11,48.77 IC1.5
MD_INPUT_2  (via drill 0.35)
  Top 0.152: v77.76,50.8 77.5,50.55 69.89,50.55 69.38,51.05 68.11,51.05 IC1.7 | 99.6,38.35 U1.27
  Top 0.813: v97.83,38.35 99.6,38.35
  Bottom 0.813: v97.83,38.35 85.38,50.8 v77.76,50.8
MD_INPUT_3  (via drill 0.35)
  Top 0.152: 99.6,35.81 U1.28
  Top 0.813: 99.6,35.81 97.83,34.04 v96.05,34.04
  Bottom 0.152: 70.65,36.07 70.65,53.85 69.63,54.86 63.03,54.86 IC1.10
  Bottom 0.813: v96.05,34.04 94.02,36.07 70.65,36.07
MD_INPUT_4  (via drill 0.35)
  Top 0.152: 99.6,33.27 U1.29
  Top 0.813: v97.83,33.27 99.6,33.27
  Bottom 0.152: 75.73,36.58 75.73,57.15 72.93,59.94 65.06,59.94 65.06,59.44 63.03,57.4 IC1.12
  Bottom 0.813: v97.83,33.27 94.52,36.58 75.73,36.58
N$1  (via drill 0.35)
  Top 0.152: D1.A 78.52,62.48 78.52,56.13 D2.C 78.27,55.88 74.97,52.58 v65.82,52.58
  Bottom 0.152: 59.41,47.05 IC1.2 63.03,44.7 65.06,46.74 65.06,51.82 v65.82,52.58 | 40.68,44.96 J2.1
  Bottom 0.813: 59.41,47.05 55.15,51.31 39.41,51.31 39.41,46.23 40.68,44.96
N$2  (via drill 0.35)
  Top 0.152: D4.C 84.62,56.39 v84.62,57.91 84.62,62.48 D3.A | v77,46.48 76.74,46.23 68.11,46.23 IC1.3 67.85,45.97 67.09,45.97 v64.81,43.69
  Bottom 0.152: v84.62,57.91 77,57.91 v77,46.48 | 40.93,48.26 J2.2
  Bottom 0.813: 40.93,48.26 47.28,41.91 64.81,41.91 v64.81,43.69
N$3  (via drill 0.35)
  Top 0.152: 79.54,37.08 84.62,37.08 D8.C | 79.54,37.08 78.27,37.08 D6.A | 62.52,60.45 62.77,60.2 IC1.14 | 41.44,60.45 40.93,60.96 J3.2 | v79.54,37.34 79.54,37.08
  Top 0.813: 41.44,60.45 62.52,60.45
  Bottom 0.152: v79.54,37.34 76.24,40.64 76.24,57.15 70.9,62.48 63.28,62.48 63.28,60.45 63.03,60.2 IC1.14
N$4  (via drill 0.35)
  Top 0.152: D7.C 84.36,43.18 84.36,45.21 80.81,45.21 79.28,46.74 78.52,46.74 D5.A 78.27,46.99 78.01,47.24 77,47.24 v74.97,49.28 | v61,64.01 62.01,61.72 64.55,61.72 67.34,58.93 67.85,58.93 IC1.13
  Bottom 0.152: v74.97,49.28 73.7,50.55 73.7,58.67 68.11,58.67 IC1.13 | 40.93,57.66 J3.1
  Bottom 0.813: 40.93,57.66 47.28,64.01 v61,64.01
N$5
  Top 0.152: 75.22,90.68 82.08,83.82 LED2.C | 75.22,90.68 70.39,90.68 T2.3 | 75.22,90.68 D10.A
  Bottom 0.152: K2.1 90.21,96.77 84.11,90.68 75.47,90.68 D10.A
N$6
  Top 0.152: LED2.A 82.33,86.11 82.33,90.42 R3.1
N$7
  Top 0.152: R4.1 69.63,88.65 69.38,88.65 T2.1
N$8  (via drill 0.35)
  Top 0.152: T1.3 86.9,91.19 91.22,91.19 91.47,90.93 91.98,90.93 D9.A | v66.84,84.07 65.82,84.07 LED1.C
  Bottom 0.152: v66.84,84.07 73.7,90.93 K1.1 73.7,98.3 90.97,98.3 91.73,97.54 91.73,91.19 91.98,90.93 D9.A
N$9
  Top 0.152: LED3.C 98.84,84.07 100.87,86.11 100.87,90.93 103.16,90.93 T3.3 103.16,91.19 107.73,91.19 107.99,90.93 108.49,90.93 D11.A
  Bottom 0.152: D11.A 108.49,90.93 106.97,92.46 106.97,96.77 K3.1
N$10
  Top 0.152: LED1.A 65.82,86.11 65.82,90.42 R1.1
N$11
  Top 0.152: LED3.A 98.84,86.11 98.84,90.42 98.59,90.42 R5.1
N$12
  Top 0.152: R2.1 85.89,84.84 85.89,88.65 T1.1
N$13
  Top 0.152: R6.1 103.67,84.84 101.89,86.61 101.89,88.65 102.14,88.65 T3.1
N$14
  Top 0.152: LED4.C 115.35,84.07 117.64,86.36 117.64,90.68 119.67,90.68 T4.3 119.92,90.68 124.75,90.68 D12.A
  Bottom 0.152: K4.1 123.23,92.46 124.75,90.93 D12.A
N$15
  Top 0.152: LED4.A 115.35,86.11 115.35,90.42 R7.1
N$16
  Top 0.152: R8.1 120.18,84.84 120.18,87.12 119.92,87.12 118.91,88.14 118.91,88.65 T4.1
N$17
  Bottom 0.152: 114.08,121.41 114.34,121.67 X3.3
  Bottom 1.016: 114.08,121.41 114.08,108.71 K4.2
N$18
  Top 0.152: 32.29,37.85 31.28,37.85 31.02,38.1 IC2.2 | 19.09,25.15 L1.1 18.83,25.15 | 11.21,25.15 10.45,25.91 D13.C
  Top 1.016: 32.29,37.85 32.8,37.34 32.8,28.7 22.64,28.7 19.09,25.15 | 18.83,25.15 11.21,25.15
N$19
  Bottom 0.152: 119.42,121.67 X3.2
  Bottom 1.016: 119.42,121.67 123.23,117.86 K4.4
N$20  (via drill 0.35)
  Top 0.152: v68.36,71.12 R10.2 | 31.28,41.91 31.02,41.66 IC2.4
  Top 0.254: v33.56,41.91 31.28,41.91
  Bottom 0.813: v68.36,71.12 55.92,83.57 43.72,83.57 | 43.72,83.57 R9.S R9.E | v33.56,41.91 38.9,47.24 38.9,75.95 43.72,80.77 43.72,83.57
N$21
  Top 0.152: LED5.A 45.5,98.04 45.5,103.12 45.25,103.12 R11.1
N$22
  Bottom 0.152: 124.24,121.92 X3.1
  Bottom 0.305: K4.3 115.61,125.48
  Bottom 1.016: 124.24,121.92 120.69,125.48 115.61,125.48
N$23
  Top 0.152: 30.26,87.88 IC3.2 | 9.18,85.09 D14.C | 19.09,73.15 20.1,74.17 L2.1 18.83,73.15 19.09,73.15
  Top 1.016: 9.18,85.09 20.1,74.17 24.93,78.99 30.77,78.99 34.58,82.8 34.58,86.61 33.31,87.88 30.26,87.88 30.01,87.63
N$26
  Top 0.152: LED6.A 12.48,54.36 12.48,47.5 R14.1
N$37
  Bottom 0.152: 34.33,119.89 X1.1 | 51.09,117.35 S1.2
  Bottom 1.016: 34.33,119.89 50.07,119.89 50.07,118.36 51.09,117.35
N$44
  Top 0.152: R12.1 12.48,65.53 12.48,60.71 LED7.A
NC
  Bottom 0.152: 97.83,121.67 X4.3 | 64.55,121.41 64.81,121.67 X5.3 65.06,121.92 | 66.08,107.44 K1.2 66.08,107.19 | 81.31,121.92 X6.3 | 82.59,107.19 K2.2 | 97.83,111 83.6,111 83.35,110.74 74.97,110.74 74.46,111.25 72.17,111.25 72.17,107.19
  Bottom 0.305: 64.55,121.41 64.55,108.97 66.08,107.44 | 81.31,121.92 76.24,121.92 76.24,122.94 75.22,123.95 65.06,123.95 65.06,121.92
  Bottom 1.016: 97.83,121.67 97.83,111 97.83,108.46 K3.2 | 66.08,107.19 72.17,107.19 82.59,107.19
NO
  Bottom 0.152: 99.35,113.28 99.35,112.27 K3.3 | 107.73,121.67 X4.1 | 82.59,113.03 82.59,114.05 | 74.97,121.67 X5.1 74.71,121.67 74.71,121.16 | 91.22,121.67 X6.1 91.47,121.92 | 82.59,112.27 K2.3 | 66.08,112.52 K1.3 | 99.09,123.19 99.09,122.68
  Bottom 0.305: 99.09,122.68 103.92,117.86 | 99.09,123.19 98.33,123.95 91.47,123.95 91.47,121.92
  Bottom 1.016: 99.35,113.28 103.92,117.86 107.73,121.67 | 82.59,114.05 74.97,121.67 | K2.3 82.59,113.03 91.22,121.67 | 74.71,121.16 66.08,112.52
RELAY1_IN  (via drill 0.35)
  Top 0.152: v86.14,79.76 86.14,82.55 R2.2 | v119.67,35.56 124.5,30.73 125,30.73 U1.9
  Bottom 0.152: v119.67,35.56 119.92,35.81
  Bottom 0.254: v86.14,79.76 96.05,69.85 117.64,69.85 117.64,55.63 119.92,53.34 119.92,35.81
RELAY2_IN  (via drill 0.35)
  Top 0.152: v76.24,80.52 69.63,80.52 R4.2 | v120.69,32 124.5,28.19 125,28.19 U1.8
  Bottom 0.152: v76.24,80.52 108.75,80.52 | v120.69,32 120.94,32.26
  Bottom 0.254: 108.75,80.52 120.18,69.09 120.18,54.1 120.94,53.34 120.94,32.26
RELAY3_IN  (via drill 0.35)
  Top 0.152: v104.94,82.8 103.92,82.8 R6.2
  Bottom 0.152: 109.76,82.8 v104.94,82.8 | 121.96,28.96 125,25.91 U1.7
  Bottom 0.254: 109.76,82.8 122.46,70.1 122.46,55.37 121.96,54.86 121.96,28.96
RELAY4_IN
  Top 0.152: 126.53,21.59 125,23.11 U1.6 | 120.43,82.8 R8.2
  Top 0.254: 120.43,82.8 135.42,67.82 135.42,21.59 126.53,21.59
RXD0
  Bottom 0.152: 99.86,20.83 U1.34
  Bottom 0.254: 113.83,68.07 115.61,66.29 115.61,65.02 116.11,64.52 JP3.7
  Bottom 0.813: 113.83,68.07 98.59,68.07 98.59,50.8 99.6,49.78 100.87,49.78 100.87,21.84 99.86,20.83
SD0
  Bottom 0.152: 100.62,53.85 99.86,53.85 U1.21 | 111.03,64.26 JP3.5
  Bottom 0.813: 100.62,53.85 111.03,64.26
SD1
  Bottom 0.152: 99.86,51.31 100.62,51.31 | 113.57,64.26 JP3.6
  Bottom 0.813: 100.62,51.31 113.57,64.26 | 99.86,51.31 U1.22
SD2  (via drill 0.35)
  Top 0.152: 118.4,54.61 108.75,64.26 JP3.4
  Top 0.254: v122.72,54.61 118.4,54.61
  Bottom 0.152: 125,48.77 U1.16
  Bottom 0.254: v122.72,54.61 123.99,53.34 123.99,49.78 125,48.77
SD3  (via drill 0.35)
  Top 0.254: v119.16,53.09 120.94,51.31 125,51.31 U1.17
  Bottom 0.152: 106.21,64.52 JP3.3
  Bottom 0.254: 106.21,64.52 107.99,66.29 115.1,66.29 115.1,57.15 v119.16,53.09
SENS_1_A  (via drill 0.35)
  Top 0.152: v96.05,15.75 85.12,15.75 82.84,13.46 JP2.5
  Bottom 0.152: v96.05,15.75 98.59,18.29 98.59,27.18 99.6,28.19 U1.31
SENS_2_A  (via drill 0.35)
  Top 0.152: v93.76,19.05 98.08,23.37 99.6,23.37 U1.33
  Bottom 0.152: v93.76,19.05 93.76,16 82.84,16 JP2.7
SENS_3_A
  Top 0.152: JP2.9 82.84,18.29 96.3,18.29 99.09,15.49 99.6,15.49 U1.36
SENS_4_A  (via drill 0.35)
  Top 0.152: v94.52,17.53 95.54,16.51 96.56,16.51 99.86,13.21 U1.37
  Bottom 0.152: v94.52,17.53 94.52,20.83 82.84,20.83 JP2.11
SENSOR_VN
  Bottom 0.152: 126.78,61.47 123.99,64.26 JP3.10 | 125.26,18.29 U1.4
  Bottom 0.254: 126.78,61.47 126.78,19.81 125.26,18.29
SENSOR_VP
  Bottom 0.152: 126.27,20.32 125.26,19.3 123.99,19.3 123.99,16.76 125,15.75 U1.3 | 121.45,64.26 JP3.9
  Bottom 0.254: 121.45,64.26 121.45,25.4 125,21.84 126.27,21.84 126.27,20.32
SERVO_1
  Top 0.152: 126.02,41.66 125.51,41.15 125.26,41.15 U1.13 | 132.88,45.47 JP1.3
  Top 0.254: 132.88,45.47 129.07,41.66 126.02,41.66
SERVO_2
  Top 0.152: JP1.6 132.88,37.85 126.02,37.85 125.51,38.35 125.26,38.35 U1.12
SERVO_3  (via drill 0.35)
  Top 0.152: v127.54,35.81 127.03,35.31 126.02,35.31 125.51,35.81 125.26,35.81 U1.11
  Bottom 0.152: 132.88,30.48 JP1.9
  Bottom 0.813: v127.54,35.81 132.88,30.48
SERVO_4
  Top 0.152: 134.91,24.64 133.13,22.86 JP1.12 | 126.02,34.04 125.51,33.53 125.26,33.53 U1.10
  Top 0.254: 134.91,24.64 134.91,34.04 126.02,34.04
TXD0
  Bottom 0.152: 120.43,35.31 103.41,18.29 99.86,18.29 U1.35 | 118.91,64.26 JP3.8
  Bottom 0.254: 118.91,64.26 119.67,63.5 119.67,54.1 120.43,53.34 120.43,35.31